# EAGLE design CANoPi (EAGLE 8.1.0)
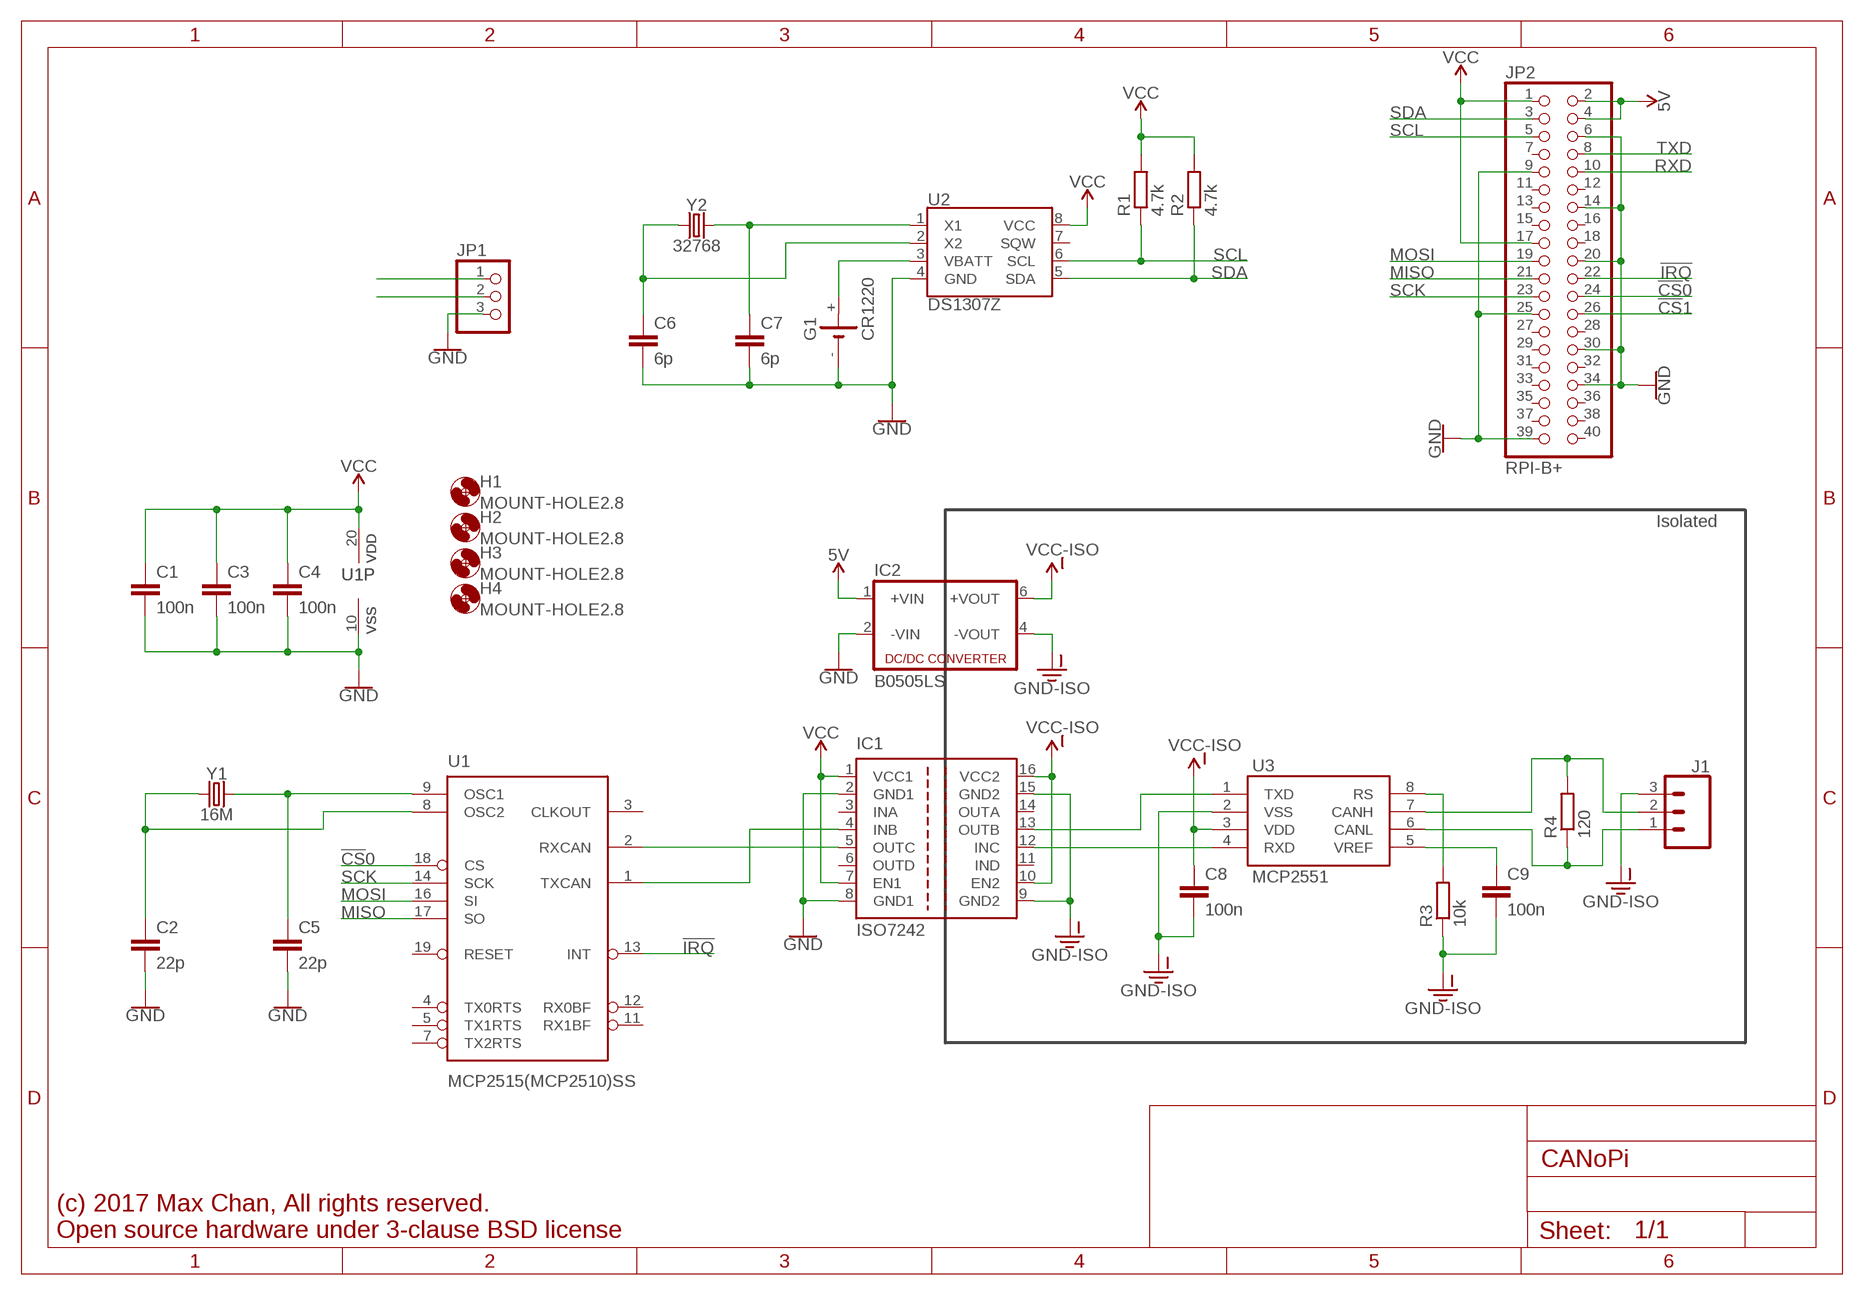
[diagram p0: schematic, sheet 1]

## Parts
C1  100n  C-EUC0603  [C0603]
C2  22p  C-EUC0603  [C0603]
C3  100n  C-EUC0603  [C0603]
C4  100n  C-EUC0603  [C0603]
C5  22p  C-EUC0603  [C0603]
C6  6p  C-EUC0603  [C0603]
C7  6p  C-EUC0603  [C0603]
C8  100n  C-EUC0603  [C0603]
C9  100n  C-EUC0603  [C0603]
G1  CR1220  CH291-1220LF  [CH291-1220LF]
H1  MOUNT-HOLE2.8  [2,8]
H2  MOUNT-HOLE2.8  [2,8]
H3  MOUNT-HOLE2.8  [2,8]
H4  MOUNT-HOLE2.8  [2,8]
IC1  ISO7242  [SO-16DW]
IC2  B0505LS  NMA-SINGLE  [NMA-SINGLE]
J1  CONN_03SCREW  [SCREWTERMINAL-3.5MM-3]
JP1  PINHD-1X3/90  [1X03/90]
JP2  RPI-B+  PINHD-2X20  [2X20]
R1  4.7k  R-EU_R0603  [R0603]
R2  4.7k  R-EU_R0603  [R0603]
R3  10k  R-EU_R0603  [R0603]
R4  120  R-EU_R0603  [R0603]
U1  MCP2515(MCP2510)SS  [SSOP20]
U2  DS1307Z  [SO08-0.15]
U3  MCP2551  [SO08]
Y1  16M  CRYSTALSMD-5X3.2-4PAD  [CRYSTAL-SMD-5X3.2-4PAD]
Y2  32768  CRYSTALSMD-3.2X1.5  [CRYSTAL-SMD-3.2X1.5MM]

## Nets
5V: IC2.1(+VIN) JP2.2 JP2.4
!CS!0: JP2.24 U1.18(CS)
!CS!1: JP2.26
!IRQ: JP2.22 U1.13(INT)
CAN_OSC1: C5.1 U1.9(OSC1) Y1.3
CAN_OSC2: C2.1 U1.8(OSC2) Y1.1
CAN_RS: R3.2 U3.8(RS)
CAN_VREF: C9.1 U3.5(VREF)
CANH: J1.2 R4.2 U3.7(CANH)
CANL: J1.1 R4.1 U3.6(CANL)
GND: C1.2 C2.2 C3.2 C4.2 C5.2 C6.2 C7.2 G1.- IC1.2(GND1) IC1.8(GND1) IC2.2(-VIN) JP1.3 JP2.6 JP2.9 JP2.14 JP2.20 JP2.25 JP2.30 JP2.34 JP2.39 U1.10(VSS) U2.4(GND)
GND-ISO: C8.2 C9.2 IC1.9(GND2) IC1.15(GND2) IC2.4(-VOUT) J1.3 R3.1 U3.2(VSS)
MISO: JP2.21 U1.17(SO)
MOSI: JP2.19 U1.16(SI)
RTCX1: C7.1 U2.1(X1) Y2.P$2
RTCX2: C6.1 U2.2(X2) Y2.P$1
RX_CAN: IC1.12(INC) U3.4(RXD)
RXCAN: IC1.5(OUTC) U1.2(RXCAN)
RXD: JP1.1 JP2.10
SCK: JP2.23 U1.14(SCK)
SCL: JP2.5 R1.1 U2.6(SCL)
SDA: JP2.3 R2.1 U2.5(SDA)
TX_CAN: IC1.13(OUTB) U3.1(TXD)
TXCAN: IC1.4(INB) U1.1(TXCAN)
TXD: JP1.2 JP2.8
VBATT: G1.+ U2.3(VBATT)
VCC: C1.1 C3.1 C4.1 IC1.1(VCC1) IC1.7(EN1) JP2.1 JP2.17 R1.2 R2.2 U1.20(VDD) U2.8(VCC)
VCC-ISO: C8.1 IC1.10(EN2) IC1.16(VCC2) IC2.6(+VOUT) U3.3(VDD)
Unconnected: IC1.3(INA) IC1.6(OUTD) IC1.11(IND) IC1.14(OUTA) JP2.7 JP2.11 JP2.12 JP2.13 JP2.15 JP2.16 JP2.18 JP2.27 JP2.28 JP2.29 JP2.31 JP2.32 JP2.33 JP2.35 JP2.36 JP2.37 JP2.38 JP2.40 U1.3(CLKOUT) U1.4(TX0RTS) U1.5(TX1RTS) U1.7(TX2RTS) U1.11(RX1BF) U1.12(RX0BF) U1.19(RESET) U2.7(SQW)

## Notes on the sheet
- Isolated
- (c) 2017 Max Chan, All rights reserved.
  Open source hardware under 3-clause BSD license

## Library data of the parts
C1-C9 = rcl:C-EU: CAPACITOR, European symbol
G1 = battery:CH291-1220LF: Battery Holder, SMT, 12mm multicomp PART NO. CH291-1220LF Source: Data sheet <http://www.farnell.com/datasheets/1505860.pdf>
H1-H4 = holes:MOUNT-HOLE: MOUNTING HOLE with drill center marker
IC1 = texas:ISO7242: HIGH SPEED QUAD DIGITAL ISOLATORS Source: http://focus.ti.com/lit/ds/symlink/iso7240m.pdf; MPN: ISO7242MDW; OC_FARNELL: 1755127; OC_NEWARK: 73M3163
IC2 = CANoPi:NMA-SINGLE
J1 = SparkFun-Connectors:CONN_03: Multi connection point. Often used as Generic Header-pin footprint for 0.1 inch spaced/style header connections On any of the 0.1 inch spaced packages, you can populate with these: Break Away Headers - Straight <https://www.sparkfun.com/products/116> (PRT-00116) Break Away Male Headers - Right Angle <https://www.sparkfun.com/products/553> (PRT-00553) Female Headers <https://www.sparkfun.com/products/115> (PRT-00115) Break Away Headers - Machine Pin <https://www.sparkfun.com/products/117> (PRT-00117) Break Away Female Headers - Swiss Machine Pin <https://www.sparkfun.com/products/743> (PRT-00743) Stackable Header - 3 Pin (Female, 0.1") <https://www.sparkfun.com/products/13875> (PRT-13875) For SCREWTERMINALS and SPRING TERMINALS visit here: Screw Terimnals on SparkFun.com <https://www.sparkfun.com/search/results?term=Screw+Terminals> (5mm/3.5mm/2.54mm spacing) This device is also useful as a general connection point to wire up your design to another part of your project. Our various solder wires solder well into these plated through hole pads. Hook-Up Wire - Assortment (Stranded, 22 AWG) <https://www.sparkfun.com/products/11375> (PRT-11375) Hook-Up Wire - Assortment (Solid Core, 22 AWG) <https://www.sparkfun.com/products/11367> (PRT-11367) View the entire wire category on our website here <https://www.sparkfun.com/categories/141> Special notes: Molex polarized connector foot print use with SKU : PRT-08232 with associated crimp pins and housings.; PROD_ID: CONN-08288; SF_ID: PRT-08235
JP1 = pinhead:PINHD-1X3: PIN HEADER
JP2 = pinhead:PINHD-2X20: PIN HEADER
R1-R4 = rcl:R-EU_: RESISTOR, European symbol
U1 = SparkFun-IC-Comms:MCP2515(MCP2510): CAN controller with SPI interface The MCP2515 controller supercedes the MCP2510 while addressing all errata associated with it. The two devices are pin compatible, either can be used with this device. 18-pin package SOIC Simple SPI interface to any MCU. One-shot mode ensures message transmission is attempted only once Databyte filtering Start-of-Frame (SOF) output Low-power CMOS Technology Datasheet <http://www.sparkfun.com/datasheets/DevTools/Arduino/MCP2515.pdf> SparkFun Products CAN-BUS Shield <https://www.sparkfun.com/products/13262> (DEV-13262)
U2 = SparkFun-Clocks:DS1307: Maxim DS1307 - I2C Real-time clock (RTC) The DS1307 serial real-time clock (RTC) is a low-power, full binary-coded decimal (BCD) clock/calendar plus 56 bytes of NV SRAM. Address and data are transferred serially through an I2C, bidirectional bus. The clock/calendar provides seconds, minutes, hours, day, date, month, and year information. SparkFun Products: Real Time Clock Module <https://www.sparkfun.com/products/12708> (BOB-12708) Datasheet <https://cdn.sparkfun.com/datasheets/BreakoutBoards/DS1307.pdf>; PROD_ID: IC-08138
U3 = SparkFun-IC-Comms:MCP2551: MCP2551 High Speed CAN Transceiver High speed CAN transceiver Datasheet <http://www.sparkfun.com/datasheets/DevTools/Arduino/MCP2551.pdf> SparkFun Products CAN-BUS Shield <https://www.sparkfun.com/products/13262> (DEV-13262) SparkFun OBD-II UART <https://www.sparkfun.com/products/9555> (WIG-09555); PROD_ID: IC-09907
Y1 Y2 = SparkFun-Clocks:CRYSTAL: Crystals (Generic) These are passive quartz crystals, which can be used as a clock source for a microcontroller. Crystal's are two-terminal devices. They require external "load" capacitors to generate an oscillating signal.

## Board
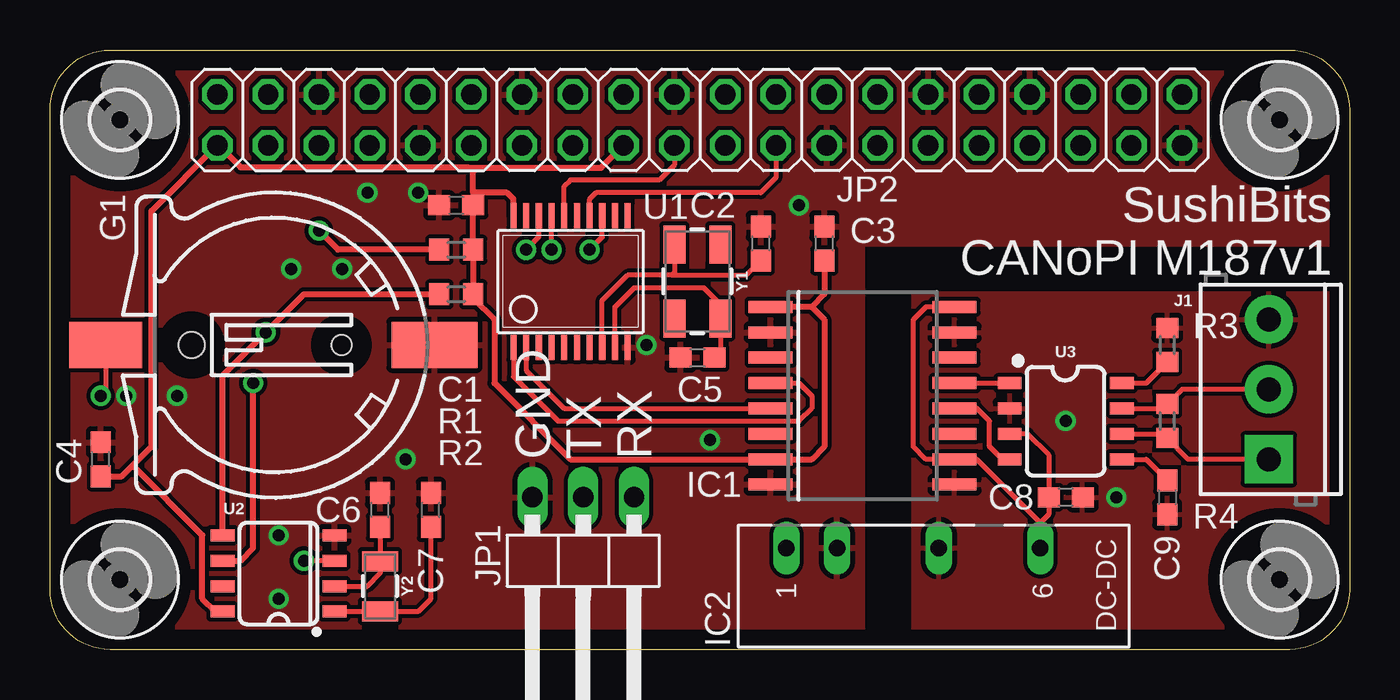
[diagram p1: board, top side]
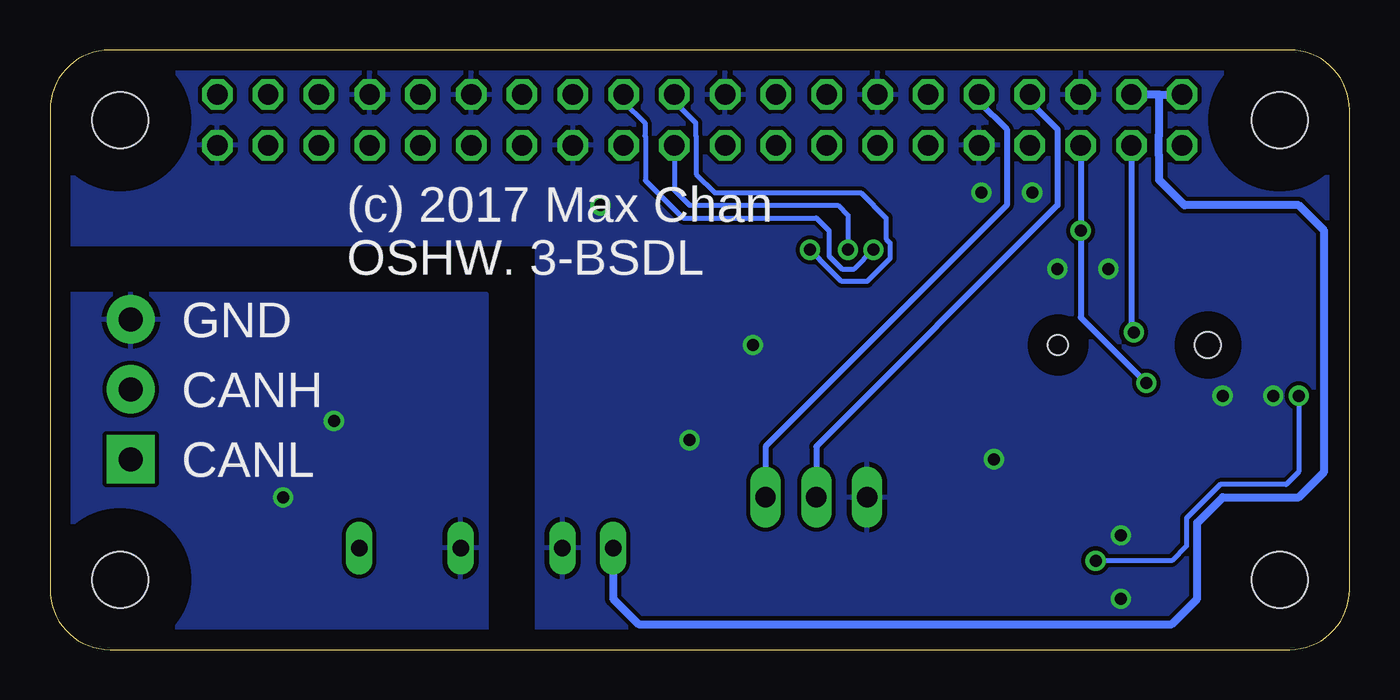
[diagram p2: board, bottom side, seen from below]

Size 65 x 30 mm. Coordinates in mm from the lower left corner, seen from the top.
Outline: 3,0 arc-90 0,3 0,27 arc-90 3,30 62,30 arc-90 65,27 65,3 arc-90 62,0 3,0
Copper layers (1*16): Top 0.035mm / dielectric 1.5mm / Bottom 0.035mm
Design rules "default": minimum track width 10mil, minimum drill 24mil, track to track 8mil, track to pad 8mil, pad to pad 8mil, via to via 8mil, smd to smd 8mil, copper to edge 40mil, drill to drill 8mil, minimum pad ring 10mil, minimum via ring 8mil, stop-mask expansion 4mil, vias tented up to drill 0mil, thermal gap 10mil

### Footprints (pad centres in the part's own frame; a part is rotated, then mirrored left to right if it is on the bottom)
C0603 = smd 1.1 x 1: 1 -0.85,0; 2 0.85,0
CH291-1220LF = smd 2.3 x 3.66: + 0,-2.296 | smd 2.3 x 4.3: - 0,14.146 | hole 1.3: 0,2 | hole 1: 0,9.5
2,8 = hole 2.8: 0,0
SO-16DW = smd 0.6 x 2.2: 1 -4.445,-4.6; 2 -3.175,-4.6; 3 -1.905,-4.6; 4 -0.635,-4.6; 5 0.635,-4.6; 6 1.905,-4.6; 7 3.175,-4.6; 8 4.445,-4.6; 9 4.445,4.6; 10 3.175,4.6; 11 1.905,4.6; 12 0.635,4.6; 13 -0.635,4.6; 14 -1.905,4.6; 15 -3.175,4.6; 16 -4.445,4.6
NMA-SINGLE = drill 0.813 long: 1 0,6.35; 2 0,3.81; 4 0,-1.27; 6 0,-6.35
SCREWTERMINAL-3.5MM-3 = drill 1.2 pad 2.413 square: 1 0,0 | drill 1.2 pad 2.413: 2 3.5,0; 3 7,0
1X03/90 = drill 1.016 long: 1 -2.54,-3.81; 2 0,-3.81; 3 2.54,-3.81
2X20 = drill 1.016 octagon: 1 -24.13,-1.27; 2 -24.13,1.27; 3 -21.59,-1.27; 4 -21.59,1.27; 5 -19.05,-1.27; 6 -19.05,1.27; 7 -16.51,-1.27; 8 -16.51,1.27; 9 -13.97,-1.27; 10 -13.97,1.27; 11 -11.43,-1.27; 12 -11.43,1.27; 13 -8.89,-1.27; 14 -8.89,1.27; 15 -6.35,-1.27; 16 -6.35,1.27; 17 -3.81,-1.27; 18 -3.81,1.27; 19 -1.27,-1.27; 20 -1.27,1.27; 21 1.27,-1.27; 22 1.27,1.27; 23 3.81,-1.27; 24 3.81,1.27; 25 6.35,-1.27; 26 6.35,1.27; 27 8.89,-1.27; 28 8.89,1.27; 29 11.43,-1.27; 30 11.43,1.27; 31 13.97,-1.27; 32 13.97,1.27; 33 16.51,-1.27; 34 16.51,1.27; 35 19.05,-1.27; 36 19.05,1.27; 37 21.59,-1.27; 38 21.59,1.27; 39 24.13,-1.27; 40 24.13,1.27
R0603 = smd 1 x 1.1: 1 -0.85,0; 2 0.85,0
SSOP20 = smd 0.305 x 1.245: 1 -2.857,-3.302; 2 -2.222,-3.302; 3 -1.587,-3.302; 4 -0.952,-3.302; 5 -0.317,-3.302; 6 0.318,-3.302; 7 0.953,-3.302; 8 1.588,-3.302; 9 2.223,-3.302; 10 2.858,-3.302; 11 2.858,3.302; 12 2.223,3.302; 13 1.588,3.302; 14 0.953,3.302; 15 0.318,3.302; 16 -0.317,3.302; 17 -0.952,3.302; 18 -1.587,3.302; 19 -2.222,3.302; 20 -2.857,3.302
SO08-0.15 = smd 0.6 x 1.2: 1 -1.905,-2.8; 2 -0.635,-2.8; 3 0.635,-2.8; 4 1.905,-2.8; 5 1.905,2.8; 6 0.635,2.8; 7 -0.635,2.8; 8 -1.905,2.8
SO08 = smd 0.6 x 1.2: 1 -1.905,-2.8; 2 -0.635,-2.8; 3 0.635,-2.8; 4 1.905,-2.8; 5 1.905,2.8; 6 0.635,2.8; 7 -0.635,2.8; 8 -1.905,2.8
CRYSTAL-SMD-5X3.2-4PAD = smd 1.9 x 1.1: 1 -1.85,-1.15; 2 1.85,-1.15; 3 1.85,1.15; 4 -1.85,1.15
CRYSTAL-SMD-3.2X1.5MM = smd 1 x 1.8: P$1 -1.25,0; P$2 1.25,0

### Placement (x,y rotation side)
C1  20.32,22.23 180 top
C2  35.56,20.32 90 top
C3  38.73,20.32 90 top
C4  2.54,9.53 90 top
C5  32.38,14.61 180 top
C6  16.51,6.99 90 top
C7  19.05,6.99 90 top
C8  50.8,7.62 0 top
C9  55.88,7.62 270 top
G1  5.08,15.24 270 top
H1  61.5,26.5 0 top
H2  3.5,26.5 0 top
H3  61.5,3.5 0 top
H4  3.5,3.5 0 top
IC1  40.64,12.7 270 top
IC2  43.18,5.08 90 top
J1  60.96,9.53 90 top
JP1  26.67,3.81 180 top
JP2  32.5,26.5 0 top
R1  20.32,20 0 top
R2  20.32,17.78 0 top
R3  55.88,15.24 270 top
R4  55.88,11.43 90 top
U1  26.04,18.41 0 top
U2  11.43,3.81 90 top
U3  50.8,11.43 270 top
Y1  32.38,18.41 270 top
Y2  16.51,3.17 270 top

### Tracks (layer width: path | path; a pad name or v marks a point on that pad's centre or on a via)
5V
  Bottom 0.406: 9.53,27.77 JP2.2 | 9.53,27.77 JP2.4 | IC2.1 36.83,2.54 35.56,1.27 8.89,1.27 7.62,2.54 7.62,6.35 6.35,7.62 2.54,7.62 1.27,8.89 1.27,20.95 2.54,22.23 8.26,22.23 9.53,23.5 9.53,24.73 9.54,24.75 9.54,25.71 9.53,25.73 9.53,27.77
!CS!0  (via drill 0.6)
  Top 0.254: U1.18 24.45,20.64 v23.81,20
  Bottom 0.254: JP2.24 36.31,27.42 35.24,26.35 35.24,25.71 35.22,25.68 35.22,23.47 33.34,21.59 26.67,21.59 26.04,20.95 26.04,19.68 25.4,19.05 24.77,19.05 v23.81,20
!IRQ  (via drill 0.6)
  Top 0.254: v26.99,20 27.62,20.64 U1.13
  Bottom 0.254: JP2.22 33.77,27.42 32.7,26.35 32.7,25.71 32.68,25.68 32.68,23.79 31.75,22.86 24.45,22.86 23.18,21.59 23.18,20.55 22.98,20.35 22.98,19.57 24.13,18.41 25.41,18.41 26.49,19.5 26.49,19.51 v26.99,20
CAN_OSC1
  Top 0.254: U1.9 28.26,17.14 29.21,18.1 32.7,18.1 33.53,17.27 Y1.3 33.53,14.9 C5.1
CAN_OSC2
  Top 0.254: U1.8 27.62,17.46 28.89,18.73 31.11,18.73 | 31.11,18.73 34.82,18.73 C2.1 | Y1.1 31.23,18.85 31.11,18.73
CAN_RS
  Top 0.254: U3.8 54.83,13.34 R3.2
CAN_VREF
  Top 0.254: U3.5 54.83,9.53 C9.1
CANH
  Top 0.254: U3.7 55.66,12.06 R4.2 56.62,13.03 J1.2
CANL
  Top 0.254: U3.6 55.66,10.79 R4.1 56.94,9.53 J1.1
GND  (via drill 0.6)
  other vias: 29.84,15.24 33.02,10.48 11.43,5.71 11.43,2.54 3.81,12.7 6.35,12.7 15.88,22.86 18.41,22.86 14.61,19.05 12.06,19.05 17.78,9.53 37.47,22.23
  pour Bottom: 0,0 0,30.48 66.04,30.48 66.04,20.32 40.64,20.32 40.64,0
  pour Top: 0,0 40.64,0 40.64,20.32 66.04,20.32 66.04,30.48 0,30.48
GND-ISO  (via drill 0.6)
  other vias: 50.8,11.43 53.34,7.62
  pour Top: 43.18,0 66.04,0 66.04,17.78 43.18,17.78
  pour Bottom: 43.18,0 66.04,0 66.04,17.78 43.18,17.78
MISO  (via drill 0.6)
  Top 0.254: v25.08,20 U1.17
  Bottom 0.254: JP2.21 33.77,22.98 33.02,22.23 25.59,22.23 U1.17 v25.08,20
MOSI
  Top 0.254: U1.16 25.72,23.18 26.04,23.5 30.48,23.5 31.23,24.25 JP2.19
RTCX1
  Top 0.254: U2.1 16.49,1.91 Y2.P$2 18.43,1.93 19.05,2.54 C7.1
RTCX2
  Top 0.254: U2.2 15.88,3.17 16.51,3.81 Y2.P$1 C6.1
RX_CAN
  Top 0.254: IC1.12 46.35,12.06 46.99,11.43 46.99,10.16 47.62,9.53 U3.4
RXCAN
  Top 0.254: U1.2 23.81,13.97 25.72,12.06 IC1.5
RXD
  Bottom 0.305: JP2.10 18.53,27.42 17.14,26.04 17.14,22.23 29.21,10.16 JP1.1
SCK
  Top 0.254: U1.14 26.99,22.54 27.3,22.86 35.56,22.86 36.31,23.61 JP2.23
SCL  (via drill 0.6)
  Top 0.305: U2.6 9.53,4.45 10.16,5.08 v10.16,13.34 | R1.1 14.4,20 v13.45,20.95
  Bottom 0.305: JP2.5 v13.45,20.95 13.45,16.62 v10.16,13.34
SDA  (via drill 0.6)
  Top 0.305: U2.5 8.63,13.71 v10.79,15.88 12.7,17.78 R2.1
  Bottom 0.305: JP2.3 10.91,15.99 v10.79,15.88
TX_CAN
  Top 0.254: IC1.13 U3.1
TXCAN
  Top 0.254: U1.1 23.18,13.65 25.4,11.43 37.47,11.43 38.1,12.06 38.1,12.7 37.47,13.34 IC1.4
TXD
  Bottom 0.305: JP2.8 15.99,27.42 14.61,26.04 14.61,22.23 26.67,10.16 JP1.2
VBATT  (via drill 0.6)
  Top 0.254: G1.+ 2.78,12.94 v2.54,12.7 | U2.3 v12.7,4.45
  Bottom 0.254: v2.54,12.7 2.54,8.89 3.17,8.26 6.47,8.26 8.15,6.57 8.15,5.18 8.89,4.45 v12.7,4.45
VCC
  Top 0.305: 38.1,17.14 IC1.1 | 38.1,17.14 38.73,16.51 38.73,10.16 38.1,9.53 IC1.7 26.04,9.53 22.23,13.34 22.23,16.51 21.17,17.57 R2.2 R1.2 C1.1 21.17,22.86 | 20.95,24.11 10.45,24.11 10.43,24.13 9.53,24.13 8.43,25.23 JP2.1 5.08,21.94 5.08,10.16 4.13,9.21 | 20.95,24.11 27.57,24.11 JP2.17 | 21.17,22.86 21.17,23.9 20.95,24.11 | U1.20 23.18,22.54 22.86,22.86 21.17,22.86 | C3.1 38.73,17.78 38.1,17.14 | C4.1 3.6,8.68 4.13,9.21 | U2.8 8.26,1.91 7.62,2.54 7.62,5.71 4.13,9.21
VCC-ISO
  Top 0.254: 49.53,6.35 IC2.6 | 49.53,6.35 46.35,9.53 IC1.10 43.81,9.53 43.18,10.16 43.18,16.51 43.81,17.14 IC1.16 | U3.3 48.9,10.79 49.95,9.74 C8.1 49.95,6.77 49.53,6.35

### Text on the board
tPlace: SushiBits / CANoPI M187v1 | GND | TX | RX
bPlace: (c) 2017 Max Chan / OSHW. 3-BSDL | GND | CANH | CANL